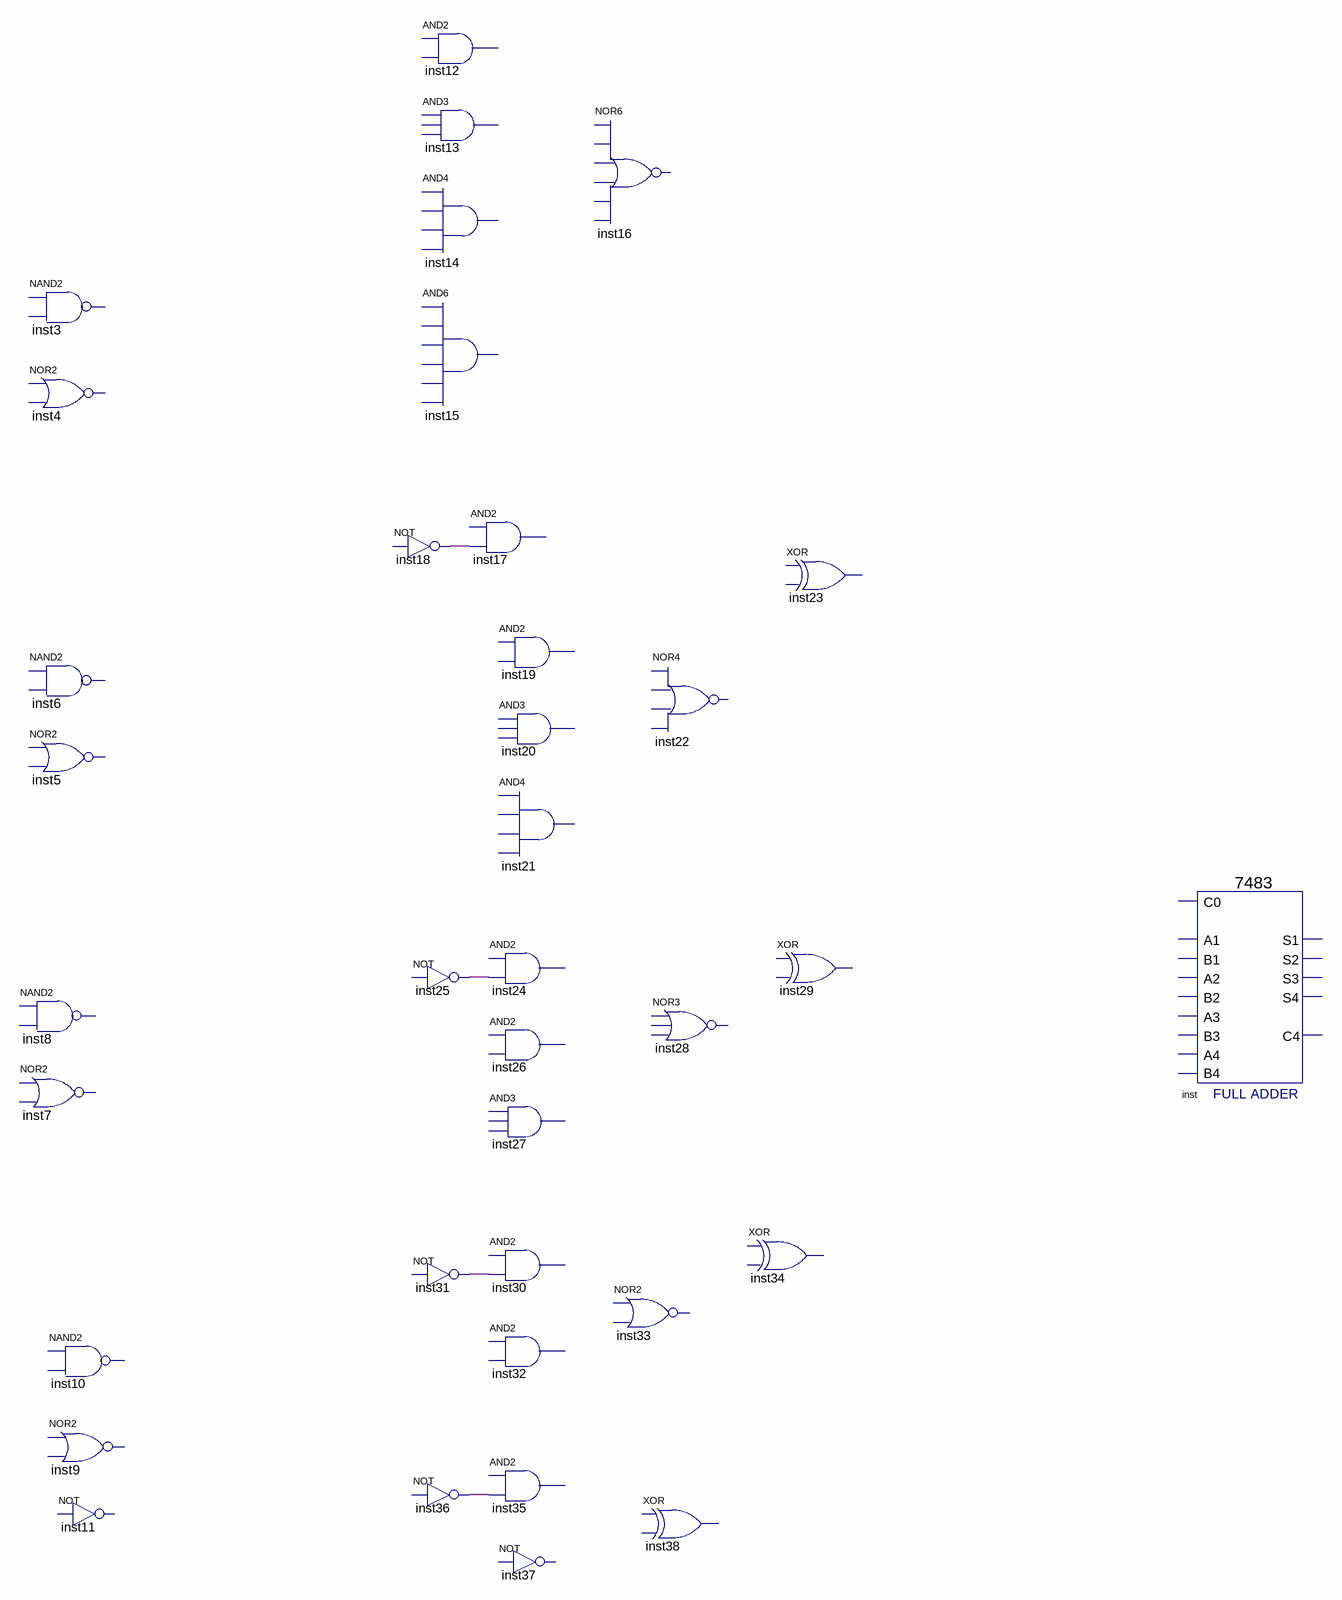
[diagram p0: schematic sheet]
// Quartus schematic SAP1-Winx.bdf as structural Verilog: 37 symbols, 0 pins
module \SAP1-Winx  (
);

  wire inst18_out, inst25_out, inst31_out, inst36_out;

  // NAND2 inst3 is placed but not wired
  // NOR2 inst4 is placed but not wired
  // NAND2 inst6 is placed but not wired
  // NOR2 inst5 is placed but not wired
  // NAND2 inst8 is placed but not wired
  // NOR2 inst7 is placed but not wired
  // NAND2 inst10 is placed but not wired
  // NOR2 inst9 is placed but not wired
  // NOT inst11 is placed but not wired
  // AND2 inst12 is placed but not wired
  // AND3 inst13 is placed but not wired
  // AND4 inst14 is placed but not wired
  // AND6 inst15 is placed but not wired
  // NOT inst18 has open pins: IN=open, OUT=inst18_out
  // NOT inst25 has open pins: IN=open, OUT=inst25_out
  // NOT inst31 has open pins: IN=open, OUT=inst31_out
  // NOT inst36 has open pins: IN=open, OUT=inst36_out
  // AND2 inst17 has open pins: IN1=open, IN2=inst18_out, OUT=open
  // AND2 inst19 is placed but not wired
  // AND3 inst20 is placed but not wired
  // AND4 inst21 is placed but not wired
  // AND2 inst24 has open pins: IN1=open, IN2=inst25_out, OUT=open
  // AND2 inst26 is placed but not wired
  // AND3 inst27 is placed but not wired
  // AND2 inst30 has open pins: IN1=open, IN2=inst31_out, OUT=open
  // AND2 inst32 is placed but not wired
  // AND2 inst35 has open pins: IN1=open, IN2=inst36_out, OUT=open
  // NOT inst37 is placed but not wired
  // NOR6 inst16 is placed but not wired
  // NOR4 inst22 is placed but not wired
  // NOR3 inst28 is placed but not wired
  // NOR2 inst33 is placed but not wired
  // XOR inst38 is placed but not wired
  // XOR inst34 is placed but not wired
  // XOR inst23 is placed but not wired
  // XOR inst29 is placed but not wired
  \7483  inst ();  // open: B4, C0, A1, A2, B1, B2, A3, B3, A4, S3, S4, S2, C4, S1
endmodule
